# Altium schematic sheet EPS_MPPT_X_OR_Solar.SchDoc: MPPT-X / Solar Panels ORing
size A4; SheetNumber: 6; SheetTotal: 51
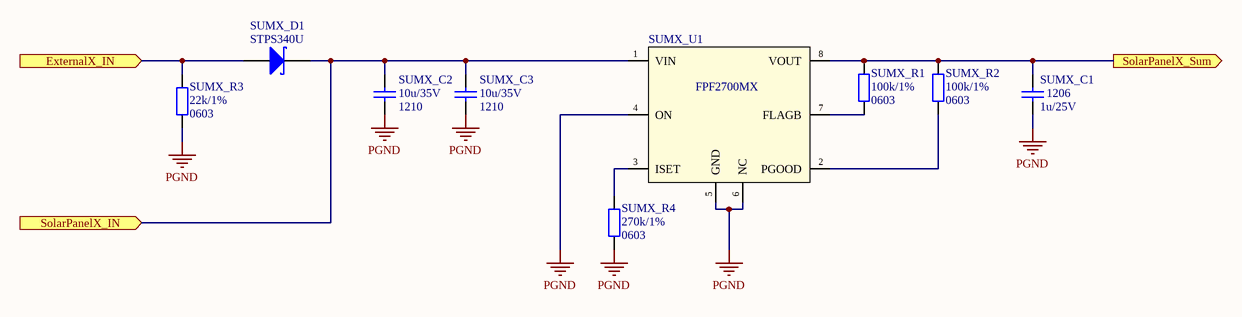
[diagram p0: EPS_MPPT_X_OR_Solar.SchDoc]

## Parts
SUMX_C1  Package: 1206  [SMD_Capacitor_1206]  (hidden comment: 1u/25V)
SUMX_C2  Package: 1210  [SMD_Capacitor_1210]  (hidden comment: 10u/35V)
SUMX_C3  Package: 1210  [SMD_Capacitor_1210]  (hidden comment: 10u/35V)
SUMX_D1  STPS340U  [DO-214AA]
SUMX_R1  Package: 0603  [SMD_Resistor_0603]  (hidden comment: 100k/1%)
SUMX_R2  Package: 0603  [SMD_Resistor_0603]  (hidden comment: 100k/1%)
SUMX_R3  Package: 0603  [SMD_Resistor_0603]  (hidden comment: 22k/1%)
SUMX_R4  Package: 0603  [SMD_Resistor_0603]  (hidden comment: 270k/1%)
SUMX_U1  FPF2700MX  [SOIC-8-N]

## Ports
ExternalX_IN (in), SolarPanelX_IN (in), SolarPanelX_Sum (out)

## Nets
PGND: SUMX_C1.2 SUMX_C2.2 SUMX_C3.2 SUMX_R3.2 SUMX_R4.2 SUMX_U1.4(ON) SUMX_U1.5(GND) SUMX_U1.6(NC)
ExternalX_IN: SUMX_D1.A SUMX_R3.1 ; port ExternalX_IN
SolarPanelX_IN: SUMX_C2.1 SUMX_C3.1 SUMX_D1.K SUMX_U1.1(VIN) ; port SolarPanelX_IN
SolarPanelX_Sum: SUMX_C1.1 SUMX_R1.1 SUMX_R2.1 SUMX_U1.8(VOUT) ; port SolarPanelX_Sum
NetSUMX_R1_2: SUMX_R1.2 SUMX_U1.7(FLAGB)
NetSUMX_R2_2: SUMX_R2.2 SUMX_U1.2(PGOOD)
NetSUMX_R4_1: SUMX_R4.1 SUMX_U1.3(ISET)

## Notes on the sheet
- Title:
- Project:
- Author:
- Model:
- Document Number:
- Checked by:
- Rev:
- Date:
- Approved by:
- Sheet:
- of
- File name:

## Library data of the parts
SUMX_C1 = Cer_C1206T105K3RALTU: Ceramic Cap Kemet COTS 1u/25V X7R 1206; ManufacturerPartNumber: C1206T105K3RALTU; Manufacturer: Kemet; Value: 1u/25V
SUMX_C2 SUMX_C3 = Cer_GCM32EC7YA106KA03K: Ceramic Cap Murata Automotive 10u/35V X7S 1210; Manufacturer: Murata; ManufacturerPartNumber: GCM32EC7YA106KA03K; Value: 10u/35V
SUMX_D1 = STPS340x: 3A/40V Power Schottky Rectifier.; Manufacturer: STMicroelectronics; Value: STPS340U
SUMX_R1-SUMX_R4 = Res
  SUMX_R1 SUMX_R2: Value: 100k/1%
  SUMX_R3: Value: 22k/1%
  SUMX_R4: Value: 270k/1%
SUMX_U1 = FPF2700MX: Adj over-current protection 0.4-2A, Load Switch; Manufacturer: Fairchild Semiconductor; Value: FPF2700MX